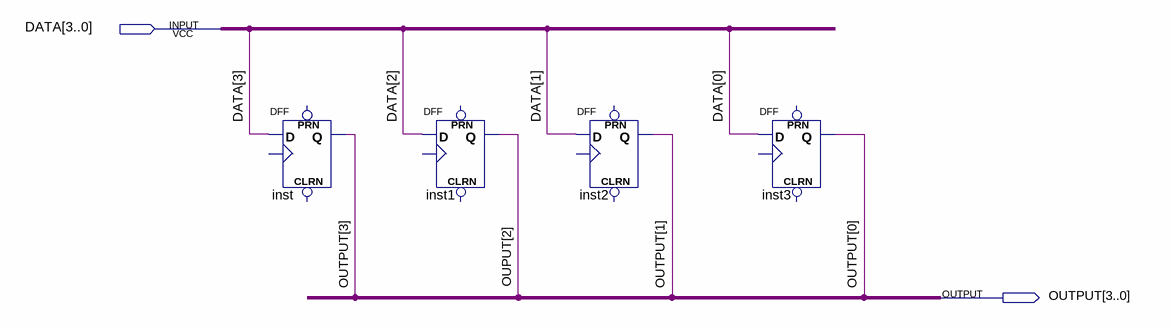
[diagram p0: schematic sheet]
// Quartus schematic REGISTER_4BIT.bdf as structural Verilog: 4 symbols, 2 pins
module REGISTER_4BIT (
  input  [3:0] DATA,
  output [3:0] OUTPUT
);

  wire [2:2] OUPUT;

  DFF inst (.D(DATA[3]), .Q(OUTPUT[3]));  // open: CLRN, CLK, PRN
  DFF inst1 (.D(DATA[2]), .Q(OUPUT[2]));  // open: CLRN, CLK, PRN
  DFF inst2 (.D(DATA[1]), .Q(OUTPUT[1]));  // open: CLRN, CLK, PRN
  DFF inst3 (.D(DATA[0]), .Q(OUTPUT[0]));  // open: CLRN, CLK, PRN
endmodule
